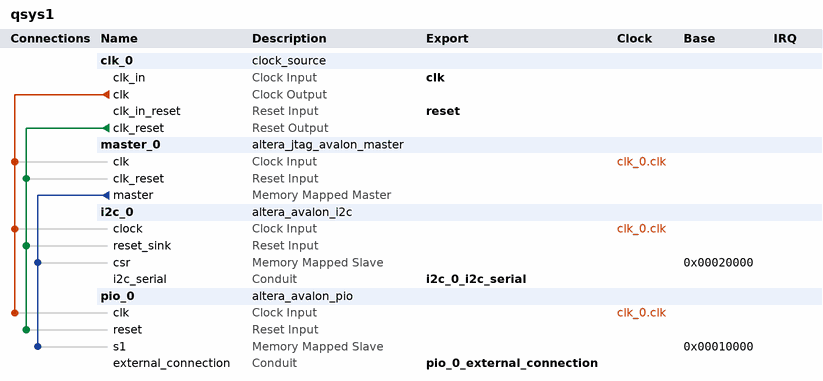
[diagram p0: system contents]
# Platform Designer (Qsys) system qsys1, Cyclone V 5CSTFD6D5F31I7
# Parameters at their usual value, and those the tool derives, are not listed.
package require -exact qsys 16.1
create_system qsys1
set_project_property DEVICE_FAMILY {Cyclone V}
set_project_property DEVICE 5CSTFD6D5F31I7

add_instance clk_0 clock_source 16.1
set_instance_parameter_value clk_0 clockFrequency 100000000
set_instance_parameter_value clk_0 resetSynchronousEdges DEASSERT

add_instance master_0 altera_jtag_avalon_master 16.1

add_instance i2c_0 altera_avalon_i2c 16.1
set_instance_parameter_value i2c_0 FIFO_DEPTH 8

add_instance pio_0 altera_avalon_pio 16.1
set_instance_parameter_value pio_0 direction Output
set_instance_parameter_value pio_0 width 32

# connections
add_connection clk_0.clk i2c_0.clock clock
add_connection clk_0.clk master_0.clk clock
add_connection clk_0.clk pio_0.clk clock
add_connection clk_0.clk_reset i2c_0.reset_sink reset
add_connection clk_0.clk_reset master_0.clk_reset reset
add_connection clk_0.clk_reset pio_0.reset reset
add_connection master_0.master i2c_0.csr avalon
set_connection_parameter_value master_0.master/i2c_0.csr baseAddress 0x00020000
add_connection master_0.master pio_0.s1 avalon
set_connection_parameter_value master_0.master/pio_0.s1 baseAddress 0x00010000

# exported interfaces
add_interface clk clock sink
set_interface_property clk EXPORT_OF clk_0.clk_in
add_interface i2c_0_i2c_serial conduit end
set_interface_property i2c_0_i2c_serial EXPORT_OF i2c_0.i2c_serial
add_interface pio_0_external_connection conduit end
set_interface_property pio_0_external_connection EXPORT_OF pio_0.external_connection
add_interface reset reset sink
set_interface_property reset EXPORT_OF clk_0.clk_in_reset

set_interconnect_requirement {$system} qsys_mm.clockCrossingAdapter HANDSHAKE
set_interconnect_requirement {$system} qsys_mm.enableEccProtection FALSE
set_interconnect_requirement {$system} qsys_mm.insertDefaultSlave FALSE
set_interconnect_requirement {$system} qsys_mm.maxAdditionalLatency 1

save_system qsys1.qsys
